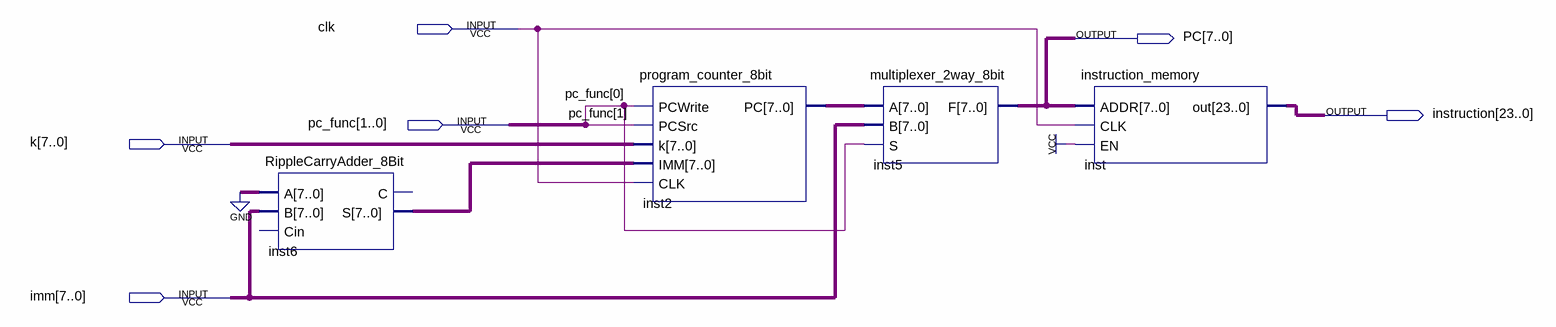
[diagram p0: schematic sheet]
// Quartus schematic pc_plus_inscruction_memory.bdf as structural Verilog: 4 symbols, 6 pins
module pc_plus_inscruction_memory (
  input  clk,
  input  [1:0] pc_func,
  input  [7:0] k,
  input  [7:0] imm,
  output [7:0] PC,
  output [23:0] instruction
);

  wire [7:0] inst2_pc, inst6_s;

  RippleCarryAdder_8Bit inst6 (.A({8{1'b0}}), .B(imm), .S(inst6_s));  // open: Cin, C
  program_counter_8bit inst2 (.PCWrite(pc_func[0]), .PCSrc(pc_func[1]), .k(k), .IMM(inst6_s), .CLK(clk), .PC(inst2_pc));
  multiplexer_2way_8bit inst5 (.A(inst2_pc), .B(imm), .S(pc_func[0]), .F(PC));
  instruction_memory inst (.ADDR(PC), .CLK(clk), .EN(1'b1), .out(instruction));
endmodule
